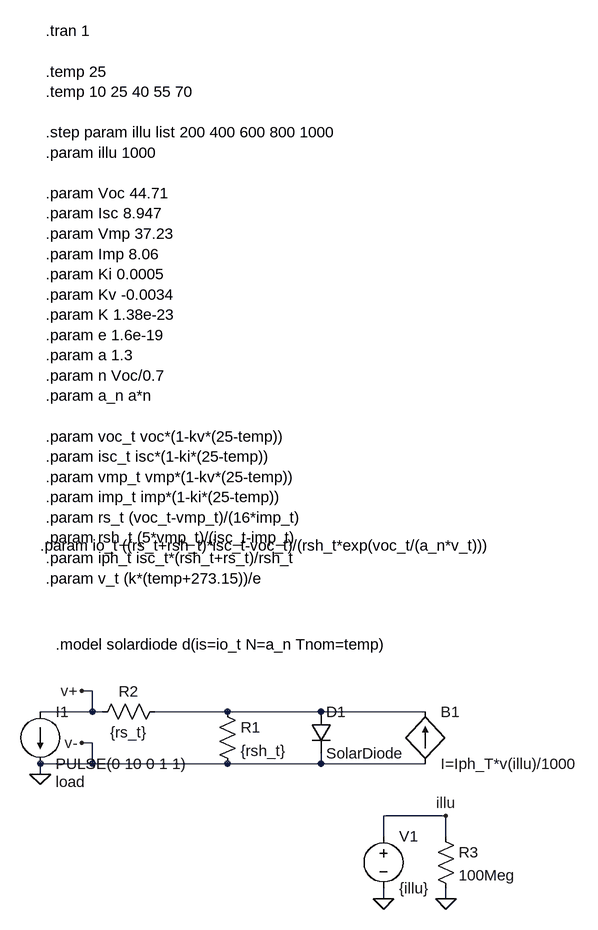
[diagram p0: schematic ComplexDiodeModel.asc]
ComplexDiodeModel.asc, the LTspice schematic file:
Version 4
SHEET 1 880 680
WIRE -112 128 -128 128
WIRE -112 160 -112 128
WIRE -112 160 -192 160
WIRE -96 160 -112 160
WIRE 96 160 -16 160
WIRE 240 160 96 160
WIRE 400 160 240 160
WIRE -112 208 -128 208
WIRE -112 240 -112 208
WIRE -112 240 -192 240
WIRE 96 240 -112 240
WIRE 240 240 240 224
WIRE 240 240 96 240
WIRE 400 240 240 240
WIRE -192 256 -192 240
WIRE 432 320 336 320
WIRE 336 352 336 320
WIRE 432 352 432 320
WIRE 336 448 336 432
WIRE 432 448 432 432
FLAG -192 256 0
FLAG -128 128 v+
FLAG -128 208 v-
FLAG 336 448 0
FLAG 432 448 0
FLAG 432 320 illu
SYMBOL bi2 400 160 R0
SYMATTR InstName B1
SYMATTR Value I=Iph_T*v(illu)/1000
SYMBOL diode 224 160 R0
SYMATTR InstName D1
SYMATTR Value SolarDiode
SYMBOL res 80 144 R0
SYMATTR InstName R1
SYMATTR Value {rsh_t}
SYMBOL res 0 144 R90
WINDOW 0 0 56 VBottom 2
WINDOW 3 32 56 VTop 2
SYMATTR InstName R2
SYMATTR Value {rs_t}
SYMBOL current -192 160 R0
WINDOW 123 0 0 Left 0
WINDOW 39 24 108 Left 2
SYMATTR SpiceLine load
SYMATTR InstName I1
SYMATTR Value PULSE(0 10 0 1 1)
SYMBOL res 416 336 R0
SYMATTR InstName R3
SYMATTR Value 100Meg
SYMBOL voltage 336 336 R0
SYMATTR InstName V1
SYMATTR Value {illu}
TEXT -184 -888 Left 2 !.tran 1\n \n.temp 25\n.temp 10 25 40 55 70\n \n.step param illu list 200 400 600 800 1000\n.param illu 1000\n \n.param Voc 44.71\n.param Isc 8.947\n.param Vmp 37.23\n.param Imp 8.06\n.param Ki 0.0005\n.param Kv -0.0034\n.param K 1.38e-23\n.param e 1.6e-19\n.param a 1.3\n.param n Voc/0.7\n.param a_n a*n\n \n.param voc_t voc*(1-kv*(25-temp))\n.param isc_t isc*(1-ki*(25-temp))\n.param vmp_t vmp*(1-kv*(25-temp))\n.param imp_t imp*(1-ki*(25-temp))\n.param rs_t (voc_t-vmp_t)/(16*imp_t)\n.param rsh_t (5*vmp_t)/(isc_t-imp_t)\n.param iph_t isc_t*(rsh_t+rs_t)/rsh_t\n.param v_t (k*(temp+273.15))/e
TEXT -168 56 Left 2 !.model solardiode d(is=io_t N=a_n Tnom=temp)
TEXT -192 -96 Left 2 !.param io_t ((rs_t+rsh_t)*isc_t-voc_t)/(rsh_t*exp(voc_t/(a_n*v_t)))

The netlist it stands for:
* ComplexDiodeModel.asc
B1 0 N001 I=Iph_T*v(illu)/1000
D1 N001 0 SolarDiode
R1 N001 0 {rsh_t}
R2 N001 v+ {rs_t}
I1 v+ 0 PULSE(0 10 0 1 1) load
R3 illu 0 100Meg
V1 illu 0 {illu}
.model D D
.lib standard.dio
.tran 1
.temp 25
.temp 10 25 40 55 70
.step param illu list 200 400 600 800 1000
.param illu 1000
.param Voc 44.71
.param Isc 8.947
.param Vmp 37.23
.param Imp 8.06
.param Ki 0.0005
.param Kv -0.0034
.param K 1.38e-23
.param e 1.6e-19
.param a 1.3
.param n Voc/0.7
.param a_n a*n
.param voc_t voc*(1-kv*(25-temp))
.param isc_t isc*(1-ki*(25-temp))
.param vmp_t vmp*(1-kv*(25-temp))
.param imp_t imp*(1-ki*(25-temp))
.param rs_t (voc_t-vmp_t)/(16*imp_t)
.param rsh_t (5*vmp_t)/(isc_t-imp_t)
.param iph_t isc_t*(rsh_t+rs_t)/rsh_t
.param v_t (k*(temp+273.15))/e
.model solardiode d(is=io_t N=a_n Tnom=temp)
.param io_t ((rs_t+rsh_t)*isc_t-voc_t)/(rsh_t*exp(voc_t/(a_n*v_t)))
.backanno
.end